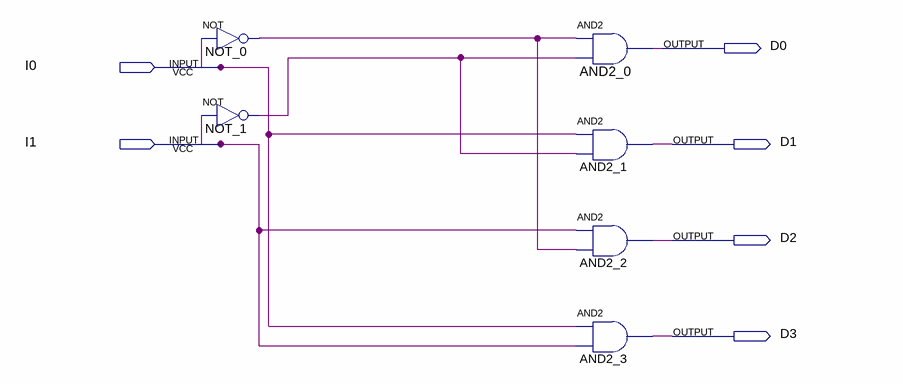
[diagram p0: schematic sheet]
// Quartus schematic dec24.bdf as structural Verilog: 6 symbols, 6 pins
module dec24 (
  input  I0,
  input  I1,
  output D0,
  output D1,
  output D2,
  output D3
);

  wire NOT_0_out, NOT_1_out;

  not NOT_0 (NOT_0_out, I0);
  not NOT_1 (NOT_1_out, I1);
  and AND2_0 (D0, NOT_0_out, NOT_1_out);
  and AND2_1 (D1, I0, NOT_1_out);
  and AND2_2 (D2, I1, NOT_0_out);
  and AND2_3 (D3, I0, I1);
endmodule
